# EasyEDA schematic Easyeda-SCH_Water-Gauge_2025-03-23.json
TITLE: Water Gauge; REV: 1.0; Date: 2024-03-26; Sheet: 1/1
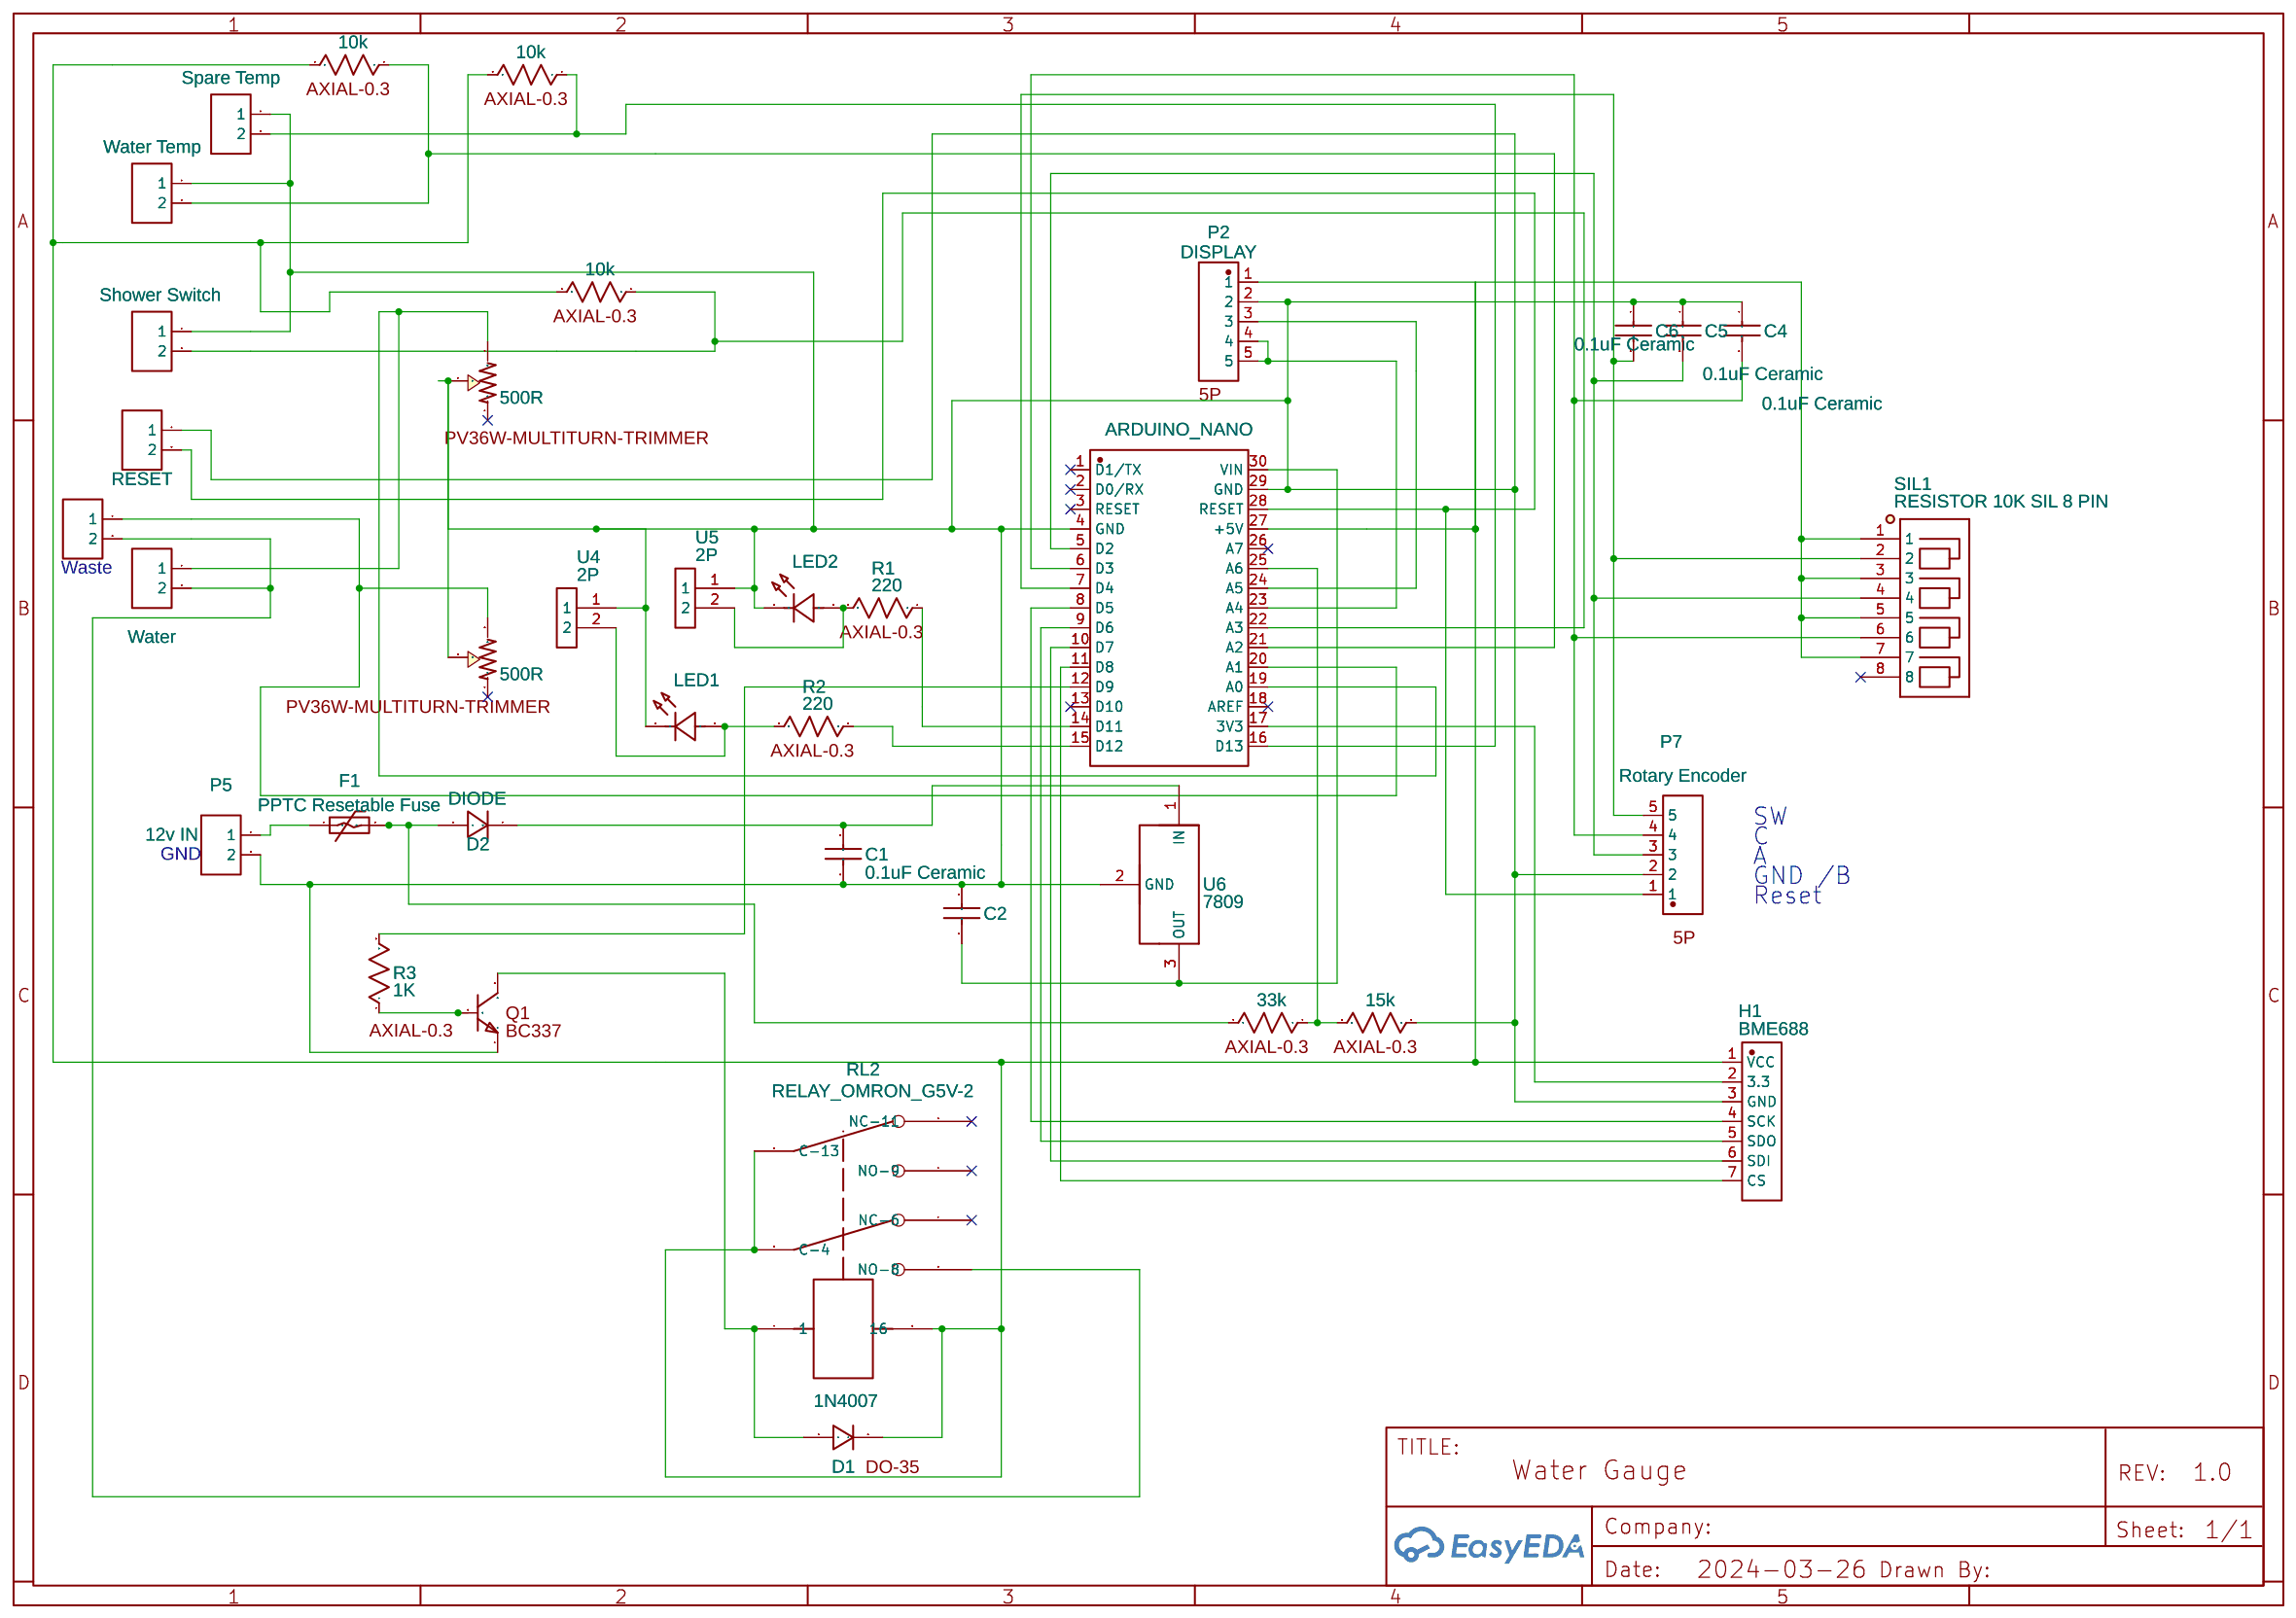
[diagram p0: schematic sheet]

## Parts
C1  0.1uF Ceramic  [CERAMIC CAPACITOR]
C2  0.1uF Ceramic  [CERAMIC CAPACITOR]
C4  0.1uF Ceramic  [CERAMIC CAPACITOR]
C5  0.1uF Ceramic  [CERAMIC CAPACITOR]
C6  0.1uF Ceramic  [CERAMIC CAPACITOR]
D1  1N4007  [DO-35]
D2  DIODE  [DO-41_BD2.4-L4.7-P8.70-D0.9-RD]
F1  PPTC Resetable Fuse  [PPTC_RESETABLE_FUSE]
H1  BME688  [HDR-TH_7P-P2.54-V-M]
LED1  LED2  [LED-TH_BD3.0-P2.54-RD-RED]
LED2  LED1  [LED-TH_BD3.0-P2.54-RD-RED]
P1  Water  [CONN-TH_2P-P5.00]
P2  DISPLAY  [5P]
P3  12v IN  [CONN-TH_2P-P5.00]
P4  Shower Switch  [CONN-TH_2P-P5.00]
P5  12v IN  [CONN-TH_2P-P5.00]
P6  Water Temp  [CONN-TH_2P-P5.00]
P7  Rotary Encoder  [5P]
P8  Spare Temp  [CONN-TH_2P-P5.00]
Q1  BD139  [TO-92-3_L4.9-W3.7-P2.54-L]
R1  220  [AXIAL-0.3]
R2  220  [AXIAL-0.3]
R3  1K  [AXIAL-0.3]
R4  33k  [AXIAL-0.3]
R5  15k  [AXIAL-0.3]
R6  10k  [AXIAL-0.3]
R9  10k  [AXIAL-0.3]
R10  10k  [AXIAL-0.3]
RESET  12v IN  [CONN-TH_2P-P5.00]
RL2  RELAY_OMRON_G5V-2  [RELAY_OMRON_G5V-2]
SIL1  RESISTOR 10K SIL 8 PIN  [RESISTOR 10K SIL 8 PIN]
U1  ARDUINO_NANO  [COMM-TH_ARDUINO_NANO]
U4  2P  [2P]
U5  2P  [2P]
U6  7809  [7805]
WASTE  500R  [PV36W-MULTITURN-TRIMMER]
WATER  500R  [PV36W-MULTITURN-TRIMMER]

## Library data of the parts
C1 C2 C4-C6 = Capacitor_Ceramic: Contributor: DIM76
D1 = 1N4007: Contributor: EasyEDA; Package Display: Yes
D2 = 1N4007GR: Contributor: LCSC; Supplier: LCSC; Supplier Part: C432605; Manufacturer: PINGWEI(平伟); JLCPCB Part Class: Extended Part
F1 = PPTC Resetable Fuse: Manufacturer: Bourns; Manufacturer Part: MF-R005-AP; Supplier: Mouser; Supplier Part: 652-MF-R005-AP; link: https://www.mouser.fr/datasheet/2/54/mf_r-777680.pdf; Contributor: jousterde1
H1 = A2541WV-7P: Contributor: salth9max; Supplier: LCSC; Supplier Part: C225482; Manufacturer: CJT(长江连接器); JLCPCB Part Class: Extended Part
LED1 LED2 = 15400394A3590: Supplier: LCSC; Supplier Part: C5478689; Manufacturer: Wurth(伍尔特); Contributor: lcsc
P1 P3-P6 P8 RESET = CONN-TH_2P-P5.00: Supplier: LCSC; Contributor: LCEDA_Lib
P2 P7 = 5P: Contributor: djiburi.h; Package Display: Yes
Q1 = BC547: catid: 20; Contributor: luis.mathias; sim: true
R1-R6 R9 R10 = Resistor1: Resistance: 1k; Contributor: rick130590102; Supplier: YUJING; sim: true; subpart_no: 1; Package Display: Yes
RL2 = RELAY_OMRON_G5V-2: Manufacturer Part: G5V-2; Contributor: GrahamG; Manufacturer: Omron
SIL1 = RESISTOR 10K SIL 8 PIN
U1 = ARDUINO_NANO: Contributor: lcsc; Supplier: LCSC; Supplier Part: C9900017879; Manufacturer: null; JLCPCB Part Class: Extended Part
U4 U5 = 2P: Contributor: brendan.koster
U6 = 7805: Manufacturer: MOUSER; Supplier: LCSC; Contributor: hardeepbhayani0464
WASTE WATER = 1k: Contributor: rossgrady; Manufacturer Part: PV36W102C01B00; Supplier Part: 81-PV36W102C01B00; Supplier: Mouser; Manufacturer: Bourns; Package Display: Yes

## Nets
Net-(C1-1): C1.1 D2.1(C) U6.1(IN)
Net-(C1-2): C1.2 C2.1 C4.1 C5.1 C6.1 H1.3(GND) LED1.1(K) LED2.1(K) P1.1 P2.2 P4.1 P5.2 P6.1 P7.2 P8.1 Q1.1(E) R5.1 U1.4(GND) U1.29(GND) U4.1 U5.1 U6.2(GND) WASTE.2 WATER.2
Net-(C2-2): C2.2 U1.30(VIN) U6.3(OUT)
Net-(C4-2): C4.2 P7.4 SIL1.6 U1.6(D3)
Net-(C5-2): C5.2 P7.3 SIL1.4 U1.5(D2)
Net-(C6-2): C6.2 P7.5 SIL1.2 U1.7(D4)
Net-(D1-1): D1.1(A) Q1.3(C) RL2.4(1)
Net-(D1-2): D1.2(K) H1.1(VCC) P2.1 R6.2 R9.2 R10.2 RL2.3(C-13) RL2.5(16) RL2.6(C-4) SIL1.1 SIL1.3 SIL1.5 SIL1.7 U1.27(+5V)
Net-(D2-2): D2.2(A) F1.2 R4.2
Net-(F1-1): F1.1 P5.1
Net-(H1-2): H1.2(3.3) U1.17(3V3)
Net-(H1-4): H1.4(SCK) U1.8(D5)
Net-(H1-5): H1.5(SDO) U1.9(D6)
Net-(H1-6): H1.6(SDI) U1.10(D7)
Net-(H1-7): H1.7(CS) U1.11(D8)
Net-(LED1-2): LED1.2(A) R1.2 U5.2
Net-(LED2-2): LED2.2(A) R2.2 U4.2
Net-(P1-2): P1.2 P7.1 U1.28(RESET)
Net-(P2-3): P2.3 U1.24(A5)
Net-(P2-4): P2.4 P2.5 U1.23(A4)
Net-(P3-1): P3.1 U1.20(A1) WASTE.3
Net-(P3-2): P3.2 RESET.2 RL2.8(NO-8)
Net-(P4-2): P4.2 R10.1 U1.22(A3)
Net-(P6-2): P6.2 R9.1 U1.21(A2)
Net-(P8-2): P8.2 R6.1 U1.16(D13)
Net-(Q1-2): Q1.2(B) R3.1
Net-(R1-1): R1.1 U1.14(D11)
Net-(R2-1): R2.1 U1.15(D12)
Net-(R3-2): R3.2 U1.12(D9)
Net-(R4-1): R4.1 R5.2 U1.25(A6)
Net-(RESET-1): RESET.1 U1.19(A0) WATER.3

Not connected (* = marked no-connect by the designer): RL2 1(NO-9)* 2(NC-11)* 7(NC-6)*; SIL1 8*; U1 1(D1/TX)* 2(D0/RX)* 3(RESET)* 13(D10)* 18(AREF)* 26(A7)*; WASTE 1*; WATER 1*

## Notes on the sheet
- Waste
- SW
- C
- GND
- A
- GND /B
- Reset
